# Altium schematic sheet bob.SchDoc
size A4; SheetNumber: 6; SheetTotal: 8
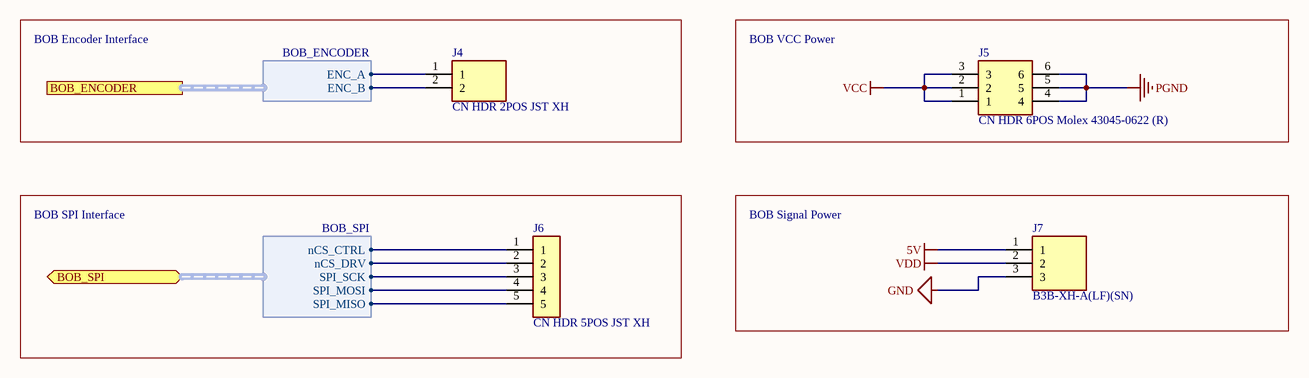
[diagram p0: bob.SchDoc]

## Parts
J4  CN HDR 2POS JST XH  [JST_B2B-XH-A(LF)(SN)]
J5  CN HDR 6POS Molex 43045-0622 (R)  [430450622]
J6  CN HDR 5POS JST XH  [JST_B5B-XH-A(LF)(SN)]
J7  B3B-XH-A(LF)(SN)  [JST_B3B-XH-A(LF)(SN)]

## Blocks framed on the sheet
BOB Encoder Interface: J4
BOB VCC Power: J5
BOB SPI Interface: J6
BOB Signal Power: J7

## Ports
BOB_ENCODER (harness BOB_ENCODER), BOB_SPI (bidir, harness BOB_SPI)

## Harnesses
BOB_ENCODER: ENC_A, ENC_B
BOB_SPI: nCS_CTRL, nCS_DRV, SPI_SCK, SPI_MOSI, SPI_MISO

## Nets
5V: J7.1
GND: J7.3
PGND: J5.4 J5.5 J5.6
VCC: J5.1 J5.2 J5.3
VDD: J7.2
NetJ4_1: J4.1 ; port BOB_ENCODER.ENC_A
NetJ4_2: J4.2 ; port BOB_ENCODER.ENC_B
NetJ6_1: J6.1 ; port BOB_SPI.nCS_CTRL
NetJ6_2: J6.2 ; port BOB_SPI.nCS_DRV
NetJ6_3: J6.3 ; port BOB_SPI.SPI_SCK
NetJ6_4: J6.4 ; port BOB_SPI.SPI_MOSI
NetJ6_5: J6.5 ; port BOB_SPI.SPI_MISO

## Library data of the parts
J4 = CN HDR 2POS JST XH: Connector Header Through Hole 2 position 0.098 _2.50mm_ / JST XH; MP: B2B-XH-A_LF__SN_; MF: JST Sales; Price: None; Package: None; Value: *; Availability: Unavailable; SnapEDA_Link: https://www.snapeda.com/parts/B2B-XH-A%28LF%29%28SN%29/JST%20Sales%20America%20Inc./view-part/492310/?ref=snap
J5 = CN HDR 6POS Molex 43045-0622 (R): Molex 43045-0622 6POS Microfit / dual row, right angle
J6 = CN HDR 5POS JST XH: Connector Header Through Hole 5 position 0.098" (2.50mm); MP: B5B-XH-A(LF)(SN); MF: JST Sales; Price: None; Package: None; Value: *; Availability: Unavailable; Digikey: 455-2270-ND; ComponentLink1Description: Digikey; ComponentLink1URL: https://www.digikey.ca/en/products/detail/jst-sales-america-inc/B5B-XH-A-LF-SN/1530483
J7 = CN 3POS TH JSTXH: CN 3POS TH JST XH; MF: JST Sales; Package: None; SnapEDA_Link: https://www.snapeda.com/parts/B3B-XH-A(LF)(SN)/JST%20Sales%20America%20Inc./view-part/231271/?ref=snap; DigiKey-Purchase-URL: https://snapeda.com/shop?store=DigiKey&id=231271; MP: B3B-XH-A(LF)(SN); Price: None; Availability: Warning; Value: *